# EAGLE schematic usb_servo (EAGLE 6.6.0)
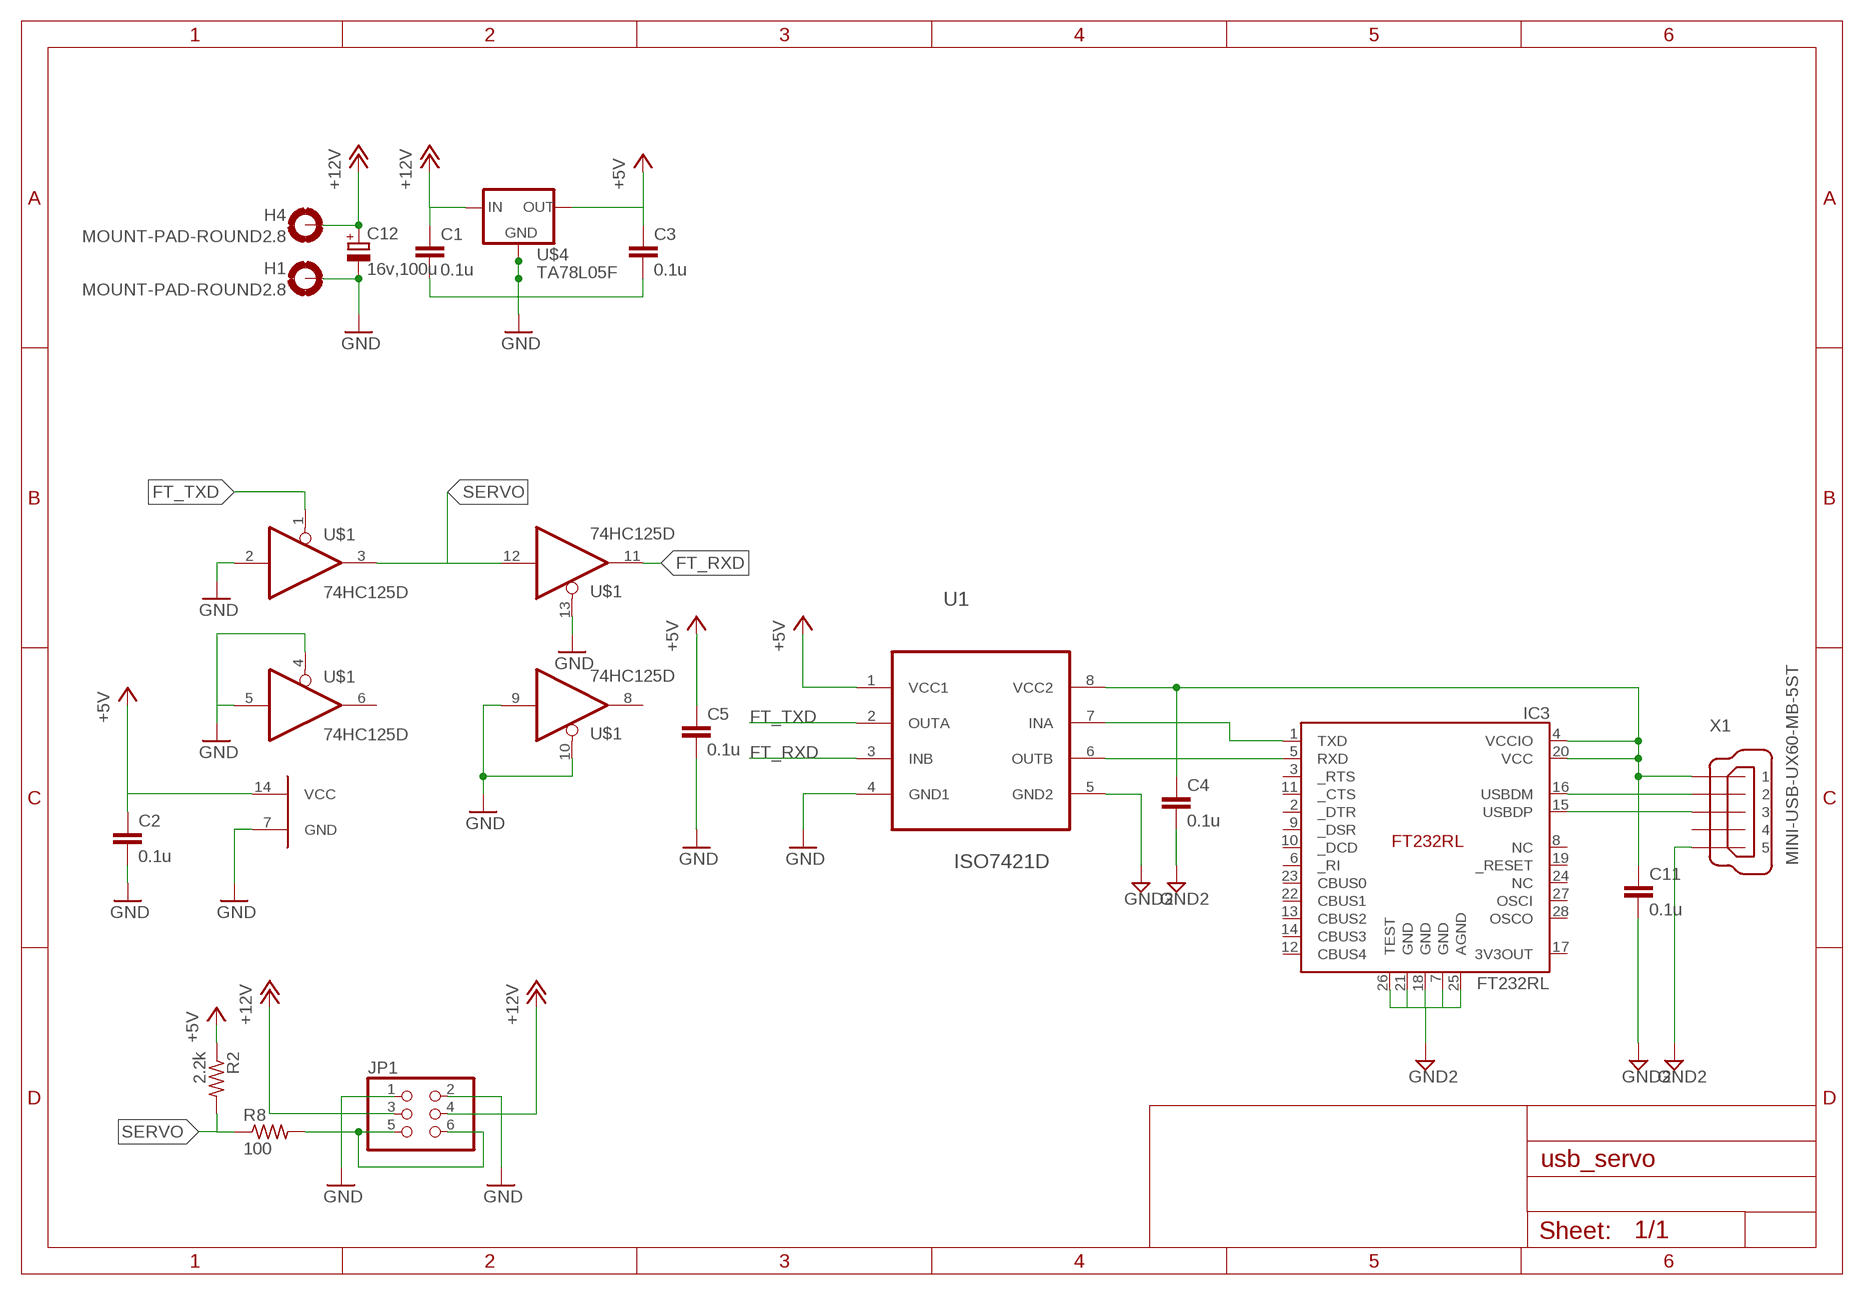
[diagram p0: schematic, sheet 1]

## Parts
C1  0.1u  C-EUC0603  [C0603]
C2  0.1u  C-EUC0603  [C0603]
C3  0.1u  C-EUC0603  [C0603]
C4  0.1u  C-EUC0603K  [C0603K]
C5  0.1u  C-EUC0603K  [C0603K]
C11  0.1u  C-EUC0603K  [C0603K]
C12  16v,100u  CPOL-EU153CLV-0605  [153CLV-0605]
H1  MOUNT-PAD-ROUND2.8  [2,8-PAD]
H4  MOUNT-PAD-ROUND2.8  [2,8-PAD]
IC3  FT232RL  [SSOP-28]
JP1  PINHD-2X3/90  [2X03/90]
R2  2.2k  R-US_R0603  [R0603]
R8  100  R-US_R0603  [R0603]
U1  ISO7421D  [SOIC127P600X175-8N]
U$1  74HC125D  [SO14]
U$4  TA78L05F  [SOT89]
X1  MINI-USB-UX60-MB-5ST  [UX60-MB-5ST]

## Nets
+5V: C2.1 C3.1 C5.1 R2.1 U1.1(VCC1) U$1.14(VCC) U$4.1(OUT)
+12V: C1.1 C12.+ H4.B2,8(MOUNT) JP1.3 JP1.4 U$4.3(IN)
FT_RXD: U1.3(INB) U$1.11(4Y)
FT_TXD: U1.2(OUTA) U$1.1(1OE)
GND [GND]: C1.2 C2.2 C3.2 C5.2 C12.- H1.B2,8(MOUNT) JP1.1 JP1.2 U1.4(GND1) U$1.2(1A) U$1.4(2OE) U$1.5(2A) U$1.7(GND) U$1.9(3A) U$1.10(3OE) U$1.13(4OE) U$4.2(GND) U$4.2@1(GND1)
GND2 [GND]: C4.2 C11.2 IC3.7(GND) IC3.18(GND) IC3.21(GND) IC3.25(AGND) IC3.26(TEST) U1.5(GND2) X1.5
N$1: IC3.5(RXD) U1.6(OUTB)
N$2: IC3.16(USBDM) X1.2
N$3: IC3.15(USBDP) X1.3
N$5: IC3.1(TXD) U1.7(INA)
N$14 [VCC]: C4.1 C11.1 IC3.4(VCCIO) IC3.20(VCC) U1.8(VCC2) X1.1
N$23: JP1.5 JP1.6 R8.2
SERVO: R2.2 R8.1 U$1.3(1Y) U$1.12(4A)
Unconnected: IC3.2(_DTR) IC3.3(_RTS) IC3.6(_RI) IC3.8(NC) IC3.9(_DSR) IC3.10(_DCD) IC3.11(_CTS) IC3.12(CBUS4) IC3.13(CBUS2) IC3.14(CBUS3) IC3.17(3V3OUT) IC3.19(_RESET) IC3.22(CBUS1) IC3.23(CBUS0) IC3.24(NC) IC3.27(OSCI) IC3.28(OSCO) U$1.6(2Y) U$1.8(3Y) X1.4

## Library data of the parts
C1-C3 = rcl:C-EU: CAPACITOR, European symbol
C4 C5 C11 = resistor:C-EU: CAPACITOR, European symbol
C12 = rcl:CPOL-EU: POLARIZED CAPACITOR, European symbol
H1 H4 = holes:MOUNT-PAD-ROUND: MOUNTING PAD, round
IC3 = ftdi:FT232RL
JP1 = pinhead:PINHD-2X3: PIN HEADER
R2 R8 = rcl:R-US_: RESISTOR, American symbol
U1 = Texas Instruments_By_element14_Batch_1:ISO7421D: Low-Power Dual Digital Isolators; DIGIKEY: 296-25187-5-ND; MPN: ISO7421D; OC_FARNELL: -; OC_NEWARK: 33R2484; PACKAGE: SOIC-8; SUPPLIER: Texas Instruments
U$1 = 74HC125D:74HC125D
U$4 = v-reg:TA78L05F
X1 = con-hirose:MINI-USB-: MINI USB Connector Source: http://www.hirose.co.jp/cataloge_hp/e24000019.pdf; OC_FARNELL: unknown; OC_NEWARK: unknown